# EAGLE design uSD_extender_female (EAGLE 6.6.0)
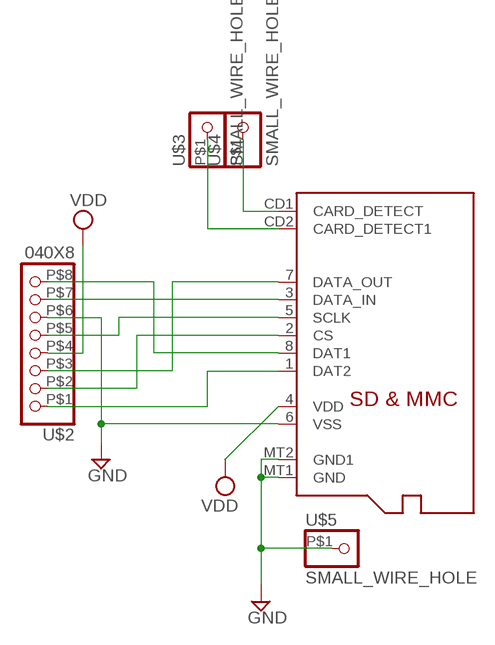
[diagram p0: schematic, sheet 1]

## Parts
U$1  MICROSD  [MICROSD]
U$2  040X8  [040X8]
U$3  SMALL_WIRE_HOLE  [SMALL_WIRE_HOLE]
U$4  SMALL_WIRE_HOLE  [SMALL_WIRE_HOLE]
U$5  SMALL_WIRE_HOLE  [SMALL_WIRE_HOLE]

## Nets
GND: U$1.MT1(GND) U$1.MT2(GND1) U$5.P$1
N$1: U$1.5(SCLK) U$2.P$5
N$2: U$1.2(CS) U$2.P$2
N$3: U$1.1(DAT2) U$2.P$1
N$4: U$1.8(DAT1) U$2.P$8
N$5: U$1.7(DATA_OUT) U$2.P$7
N$6: U$1.3(DATA_IN) U$2.P$3
N$7: U$1.CD1(CARD_DETECT) U$4.P$1
N$8: U$1.CD2(CARD_DETECT1) U$3.P$1
VDD: U$1.4(VDD) U$2.P$4
VSS: U$1.6(VSS) U$2.P$6 ; supply symbol labelled GND

## Library data of the parts
U$1 = Dean:MICROSD: Micro-SD / Transflash card holder with SPI pinout For the 3M # 2908-05WB-MG and/or 4UCON #19656 push-push type
U$2 = Dean:040X8
U$3-U$5 = Dean:SMALL_WIRE_HOLE

## Board
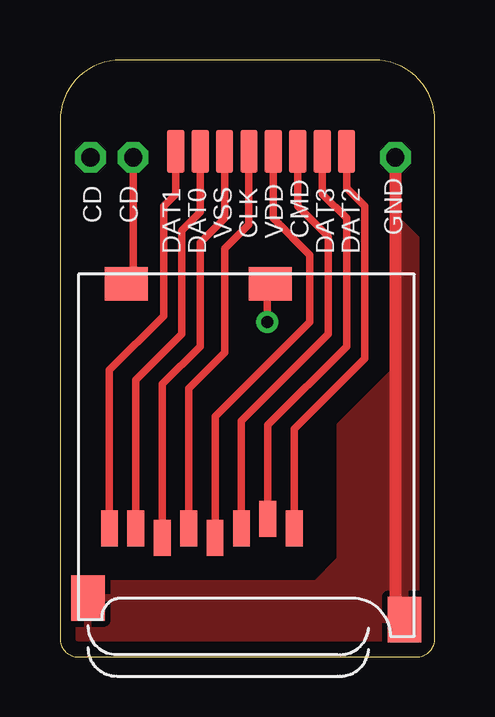
[diagram p1: board, top side]
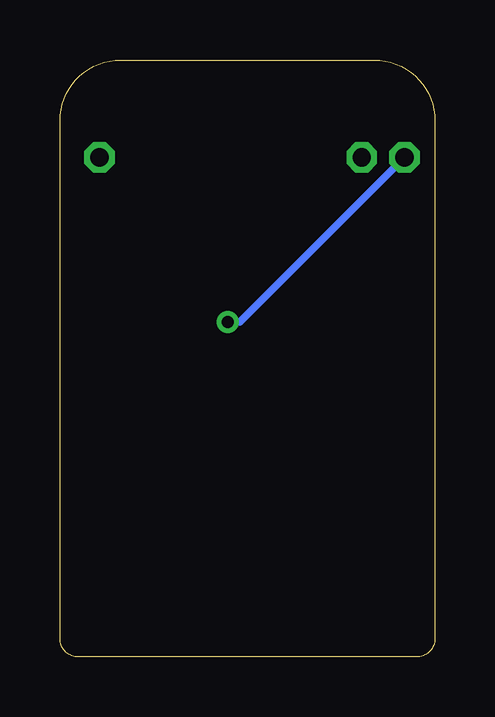
[diagram p2: board, bottom side, seen from below]

Size 15.62 x 24.89 mm. Coordinates in mm from the lower left corner, seen from the top.
Outline: 0,22.35 0,0.76 arc90 0.76,0 14.86,0 arc90 15.62,0.76 15.62,22.35 arc90 13.08,24.89 2.54,24.89 arc90 0,22.35
Copper layers (1*16): Top 0.035mm / dielectric 1.5mm / Bottom 0.035mm
Design rules "default *": minimum track width 10mil, minimum drill 13mil, track to track 8mil, track to pad 8mil, pad to pad 8mil, via to via 8mil, smd to smd 8mil, copper to edge 25mil, drill to drill 8mil, minimum pad ring 10mil, minimum via ring 8mil, stop-mask expansion 2mil, vias tented up to drill 20mil, thermal gap 10mil

### Footprints (pad centres in the part's own frame; a part is rotated, then mirrored left to right if it is on the bottom)
MICROSD = smd 0.7 x 1.5: 1 9,-10.64; 2 7.9,-10.24; 3 6.8,-10.64; 4 5.7,-11.04; 5 4.6,-10.64; 6 3.5,-11.04; 7 2.4,-10.64; 8 1.3,-10.64 | smd 1.8 x 1.4: CD1 2,-0.44; CD2 8,-0.44 | smd 1.4 x 1.9: MT1 0.4,-13.54; MT2 13.6,-14.44
040X8 = smd 0.711 x 1.778: P$1 0,0; P$2 1.016,0; P$3 2.032,0; P$4 3.048,0; P$5 4.064,0; P$6 5.08,0; P$7 6.096,0; P$8 7.112,0
SMALL_WIRE_HOLE = drill 0.762 pad 1.27 octagon: P$1 0,0

### Placement (x,y rotation side)
U$1  0.76,16 0 top
U$2  11.94,21.08 180 top
U$3  1.27,20.83 0 top
U$4  3.05,20.83 0 top
U$5  13.97,20.83 0 top

### Tracks (layer width: path | path; a pad name or v marks a point on that pad's centre or on a via)
GND
  Top 0.508: U$5.P$1 13.97,1.95 U$1.MT2
  pour Top: -0.25,3.05 10.67,3.05 11.68,4.06 11.68,9.65 13.97,11.94 13.97,18.29 16.26,16 16.26,0.25 15.75,-0.25 0,-0.25 -0.25,0
N$1
  Top 0.305: U$1.5 5.36,11.2 6.86,12.7 6.86,17.02 7.87,18.03 U$2.P$5
N$2
  Top 0.305: U$1.2 8.66,9.68 11.94,12.95 11.94,18.29 10.92,19.3 U$2.P$2
N$3
  Top 0.305: U$1.1 9.76,9.51 12.7,12.45 12.7,18.8 11.94,19.56 U$2.P$1
N$4
  Top 0.305: U$1.8 2.06,11.97 4.32,14.22 4.32,18.8 4.83,19.3 U$2.P$8
N$5
  Top 0.305: U$1.7 3.16,11.54 5.08,13.46 5.08,17.78 5.84,18.54 U$2.P$7
N$6
  Top 0.305: U$1.3 7.56,9.85 11.18,13.46 11.18,17.53 9.91,18.8 U$2.P$3
N$7
  Top 0.305: U$4.P$1 3.05,15.85 U$1.CD1
N$8  (via drill 0.51)
  Top 0.305: v8.64,13.97 8.64,15.44 U$1.CD2
  Bottom 0.305: U$3.P$1 8.13,13.97 v8.64,13.97
VDD
  Top 0.305: U$1.4 6.46,10.02 10.41,13.97 10.41,16.76 8.89,18.29 U$2.P$4
VSS
  Top 0.305: U$1.6 4.26,11.37 5.84,12.95 5.84,17.27 6.86,18.29 U$2.P$6

### Text on the board
tNames: CD | CD | GND | DAT1 | DAT0 | VSS | CLK | VDD | CMD | DAT3 | DAT2